# EAGLE design BatManagement (EAGLE 9.6.2)
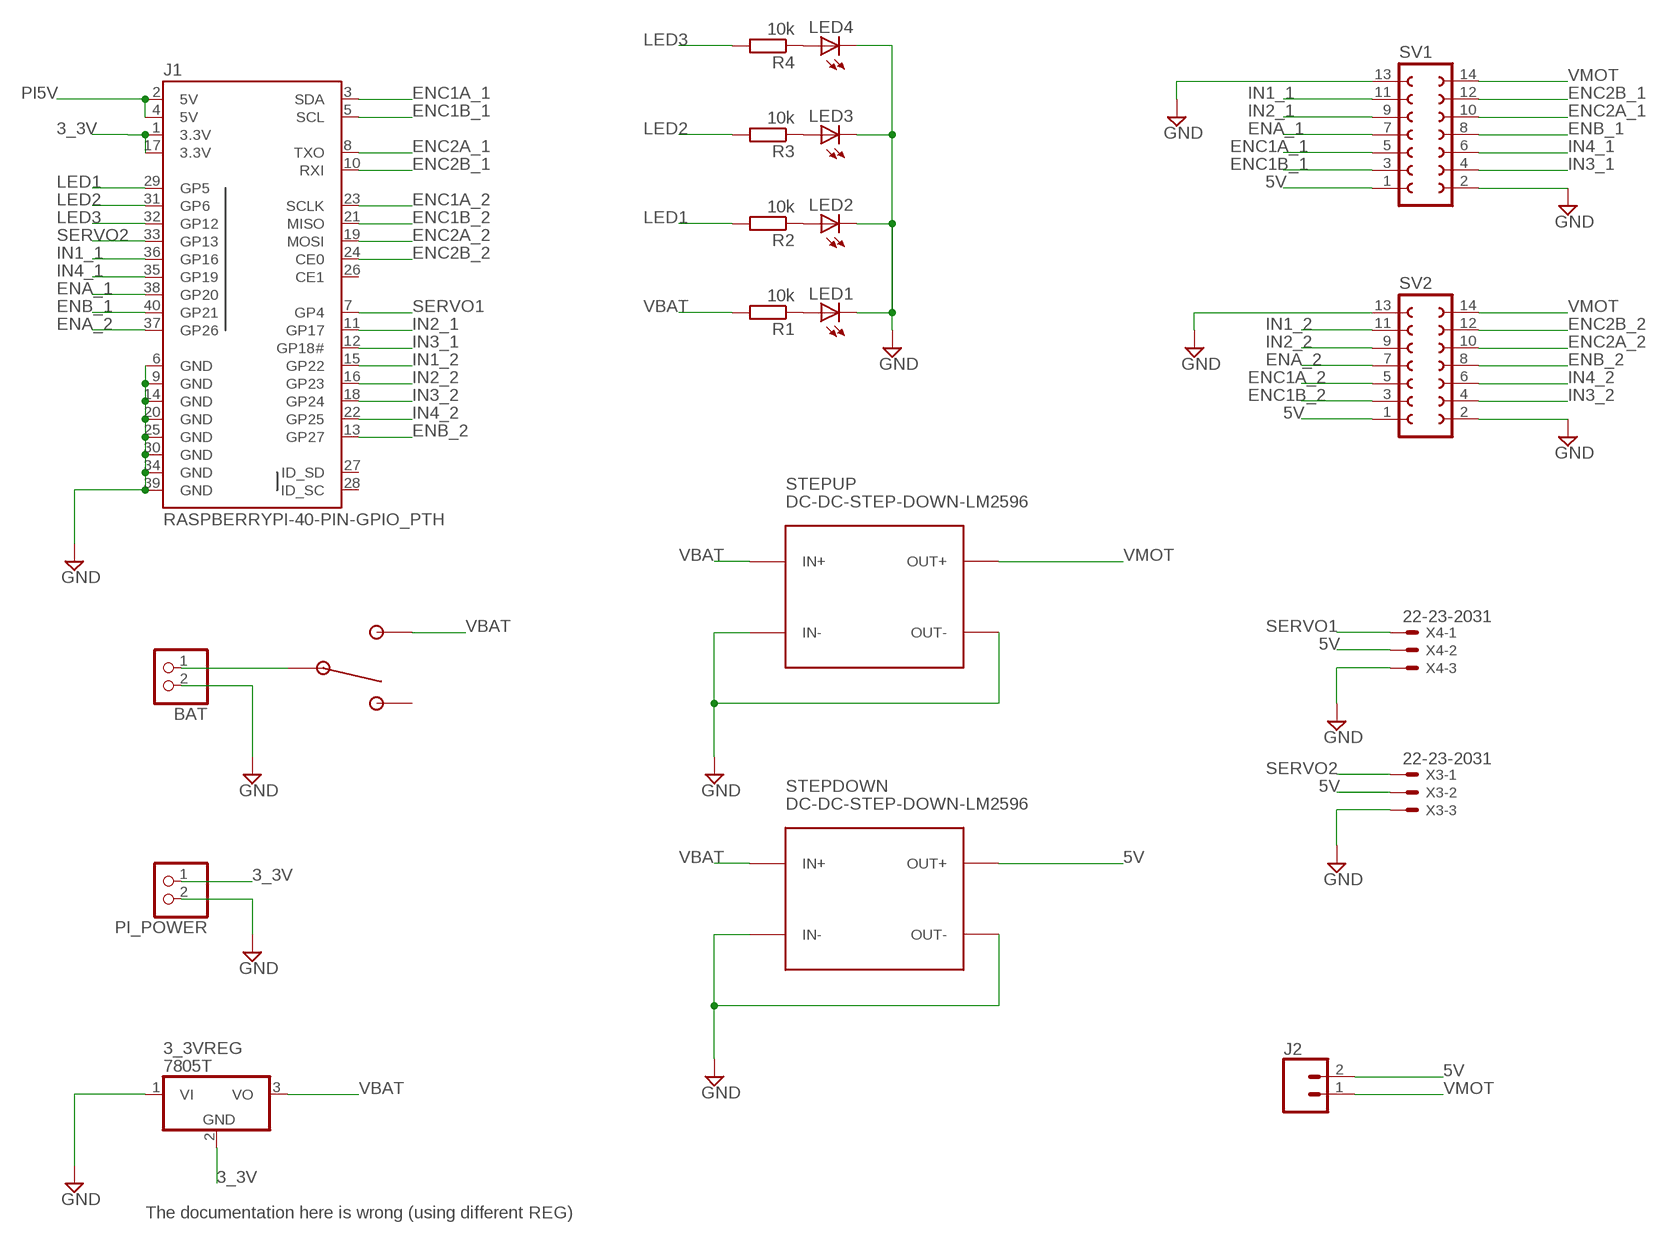
[diagram p0: schematic, sheet 1]

## Parts
3_3VREG  7805T  [TO220H]
BAT  JST_2PIN-THM  [JST-PH-2-THM]
J1  RASPBERRYPI-40-PIN-GPIO_PTH  [2X20_SHROUDED]
J2  CONN_02  [1X02]
LED1  LED5MM  [LED5MM]
LED2  LED5MM  [LED5MM]
LED3  LED5MM  [LED5MM]
LED4  LED5MM  [LED5MM]
PI_POWER  JST_2PIN-THM  [JST-PH-2-THM]
R1  10k  R-EU_0204/5  [0204/5]
R2  10k  R-EU_0204/5  [0204/5]
R3  10k  R-EU_0204/5  [0204/5]
R4  10k  R-EU_0204/5  [0204/5]
STEPDOWN  DC-DC-STEP-DOWN-LM2596  [DC-DC-STEP-DOWN-LM2596]
STEPUP  DC-DC-STEP-DOWN-LM2596  [DC-DC-STEP-DOWN-LM2596]
SV1  FE07-2  [FE07-2]
SV2  FE07-2  [FE07-2]
SW1  100SP1T2B4M6QE  [TOGGLE_RA]
X3  22-23-2031  [22-23-2031]
X4  22-23-2031  [22-23-2031]

## Nets
3_3V [Power]: 3_3VREG.2(GND) J1.1(3.3V) J1.17(3.3V) PI_POWER.1
5V [Power]: J2.2 STEPDOWN.OUT+ SV1.1 SV2.1 X3.2 X4.2
ENA_1: J1.38(GP20) SV1.7
ENA_2: J1.37(GP26) SV2.7
ENB_1: J1.40(GP21) SV1.8
ENB_2: J1.13(GP27) SV2.8
ENC1A_1: J1.3(SDA) SV1.5
ENC1A_2: J1.23(SCLK) SV2.5
ENC1B_1: J1.5(SCL) SV1.3
ENC1B_2: J1.21(MISO) SV2.3
ENC2A_1: J1.8(TXO) SV1.10
ENC2A_2: J1.19(MOSI) SV2.10
ENC2B_1: J1.10(RXI) SV1.12
ENC2B_2: J1.24(CE0) SV2.12
GND [Power]: 3_3VREG.1(VI) BAT.2 J1.6(GND) J1.9(GND) J1.14(GND) J1.20(GND) J1.25(GND) J1.30(GND) J1.34(GND) J1.39(GND) LED1.K(C) LED2.K(C) LED3.K(C) LED4.K(C) PI_POWER.2 STEPDOWN.IN- STEPDOWN.OUT- STEPUP.IN- STEPUP.OUT- SV1.2 SV1.13 SV2.2 SV2.13 X3.3 X4.3
IN1_1: J1.36(GP16) SV1.11
IN1_2: J1.15(GP22) SV2.11
IN2_1: J1.11(GP17) SV1.9
IN2_2: J1.16(GP23) SV2.9
IN3_1: J1.12(GP18#) SV1.4
IN3_2: J1.18(GP24) SV2.4
IN4_1: J1.35(GP19) SV1.6
IN4_2: J1.22(GP25) SV2.6
LED1: J1.29(GP5) R2.2
LED2: J1.31(GP6) R3.2
LED3: J1.32(GP12) R4.2
N$1: LED1.A R1.1
N$2: LED2.A R2.1
N$3: LED3.A R3.1
N$4: LED4.A R4.1
N$9 [Power]: BAT.1 SW1.2(COM)
PI5V: J1.2(5V) J1.4(5V)
SERVO1: J1.7(GP4) X4.1
SERVO2: J1.33(GP13) X3.1
VBAT [Power]: 3_3VREG.3(VO) R1.2 STEPDOWN.IN+ STEPUP.IN+ SW1.1
VMOT [Power]: J2.1 STEPUP.OUT+ SV1.14 SV2.14
Unconnected: J1.26(CE1) J1.27(ID_SD) J1.28(ID_SC) SW1.3

## Notes on the sheet
- The documentation here is wrong (using different REG)

## Library data of the parts
3_3VREG = linear:78*: Positive VOLTAGE REGULATOR Source: http://cache.national.com/ds/LM/LM78L05.pdf http://www.fairchildsemi.com/ds/LM/LM7805.pdf
BAT PI_POWER = adafruit:JST_2PIN: JST 2-Pin Connectors of various flavors SMT-RA (S2B-PH-SM4) 4UConnector #17311 SMT (B2B-PH-SM4) THM-RA (S2B-PH) THM (B2B-PH)
J1 = SparkFun-Connectors:RASPBERRYPI-40-PIN-GPIO: Raspberry Pi GPIO Header 2x20 pin connector, as found on B, B+, A+ models. Both shrouded PTH and SMT versions available. SparkFun Products: GPIO Shrouded Header <https://www.sparkfun.com/products/13054>- PTH SparkFun Pi Wedge (Preassembled) <https://www.sparkfun.com/products/13717>; PROD_ID: CONN-12263; SF_ID: PRT-13054
J2 = SparkFun-Connectors:CONN_02: Multi connection point. Often used as Generic Header-pin footprint for 0.1 inch spaced/style header connections On any of the 0.1 inch spaced packages, you can populate with these: Break Away Headers - Straight <https://www.sparkfun.com/products/116> (PRT-00116) Break Away Male Headers - Right Angle <https://www.sparkfun.com/products/553> (PRT-00553) Female Headers <https://www.sparkfun.com/products/115> (PRT-00115) Break Away Headers - Machine Pin <https://www.sparkfun.com/products/117> (PRT-00117) Break Away Female Headers - Swiss Machine Pin <https://www.sparkfun.com/products/743> (PRT-00743) For SCREWTERMINALS and SPRING TERMINALS visit here: Screw Terimnals on SparkFun.com <https://www.sparkfun.com/search/results?term=Screw+Terminals> (5mm/3.5mm/2.54mm spacing) This device is also useful as a general connection point to wire up your design to another part of your project. Our various solder wires solder well into these plated through hole pads. Hook-Up Wire - Assortment (Stranded, 22 AWG) <https://www.sparkfun.com/products/11375> (PRT-11375) Hook-Up Wire - Assortment (Solid Core, 22 AWG) <https://www.sparkfun.com/products/11367> (PRT-11367) View the entire wire category on our website here <https://www.sparkfun.com/categories/141> Special notes: Molex polarized connector foot print use with: PRT-08233 with associated crimp pins and housings. 2.54_SCREWTERM for use with PRT-10571. 3.5mm Screw Terminal footprints for PRT-08084 5mm Screw Terminal footprints for use with PRT-08432
LED1-LED4 = adafruit:LED: LED OSRAM: - CHIPLED LG R971, LG N971, LY N971, LG Q971, LY Q971, LO R971, LY R971 LH N974, LH R974 LS Q976, LO Q976, LY Q976 LO Q996 - Hyper CHIPLED LW Q18S LB Q993, LB Q99A, LB R99A - SideLED LS A670, LO A670, LY A670, LG A670, LP A670 LB A673, LV A673, LT A673, LW A673 LH A674 LY A675 LS A676, LA A676, LO A676, LY A676, LW A676 LS A679, LY A679, LG A679 - Hyper Micro SIDELED® LS Y876, LA Y876, LO Y876, LY Y876 LT Y87S - SmartLED LW L88C, LW L88S LB L89C, LB L89S, LG L890 LS L89K, LO L89K, LY L89K LS L896, LA L896, LO L896, LY L896 - TOPLED LS T670, LO T670, LY T670, LG T670, LP T670 LSG T670, LSP T670, LSY T670, LOP T670, LYG T670 LG T671, LOG T671, LSG T671 LB T673, LV T673, LT T673, LW T673 LH T674 LS T676, LA T676, LO T676, LY T676, LB T676, LH T676, LSB T676, LW T676 LB T67C, LV T67C, LT T67C, LS T67K, LO T67K, LY T67K, LW E67C LS E67B, LA E67B, LO E67B, LY E67B, LB E67C, LV E67C, LT E67C LW T67C LS T679, LY T679, LG T679 LS T770, LO T770, LY T770, LG T770, LP T770 LB T773, LV T773, LT T773, LW T773 LH T774 LS E675, LA E675, LY E675, LS T675 LS T776, LA T776, LO T776, LY T776, LB T776 LHGB T686 LT T68C, LB T68C - Hyper Mini TOPLED® LB M676 - Mini TOPLED Santana® LG M470 LS M47K, LO M47K, LY M47K Source: http://www.osram.convergy.de/
R1-R4 = rcl:R-EU_: RESISTOR, European symbol; SPICEPREFIX: R
STEPDOWN STEPUP = diy-modules:DC-DC-STEP-DOWN-LM2596: DC/DC Step-Down Regulator based on LM2596-ADJ chip LM2596 datasheet available here: http://www.ti.com/lit/ds/symlink/lm2596.pdf Click here to find device on ebay.com <http://www.ebay.com/sch/lm2596+power+regulator>
SV1 SV2 = con-lsta:FE07-2: FEMALE HEADER; OC_FARNELL: unknown; OC_NEWARK: unknown
SW1 = 100SP1T2B4M6QE:100SP1T2B4M6QE: Toggle Switch SPDT Through Hole, Right Angle 5A 120V Check prices <https://pricing.snapeda.com/parts/100SP1T2B4M6QE/E-Switch/view-part?ref=eda>; AVAILABILITY: Good; DESCRIPTION: Toggle Switch, 100 Series, SPDT, ON-NONE-ON, Sealed, 5A, 120VAC, 28VDC, R/A PC; MF: E-Switch; MP: 100SP1T2B4M6QE; PACKAGE: None; PRICE: None; PURCHASE-URL: https://pricing.snapeda.com/search/part/100SP1T2B4M6QE/?ref=eda
X3 X4 = con-molex:22-23-2031: .100" (2.54mm) Center Header - 3 Pin; MF: MOLEX; MPN: 22-23-2031; OC_FARNELL: 1462950; OC_NEWARK: 30C0862

## Net classes
0 default: width 0.4 mm, drill 0.25 mm, clearance 0.15 mm
1 Power: width 1 mm, drill 0.25 mm, clearance 0.15 mm

## Board
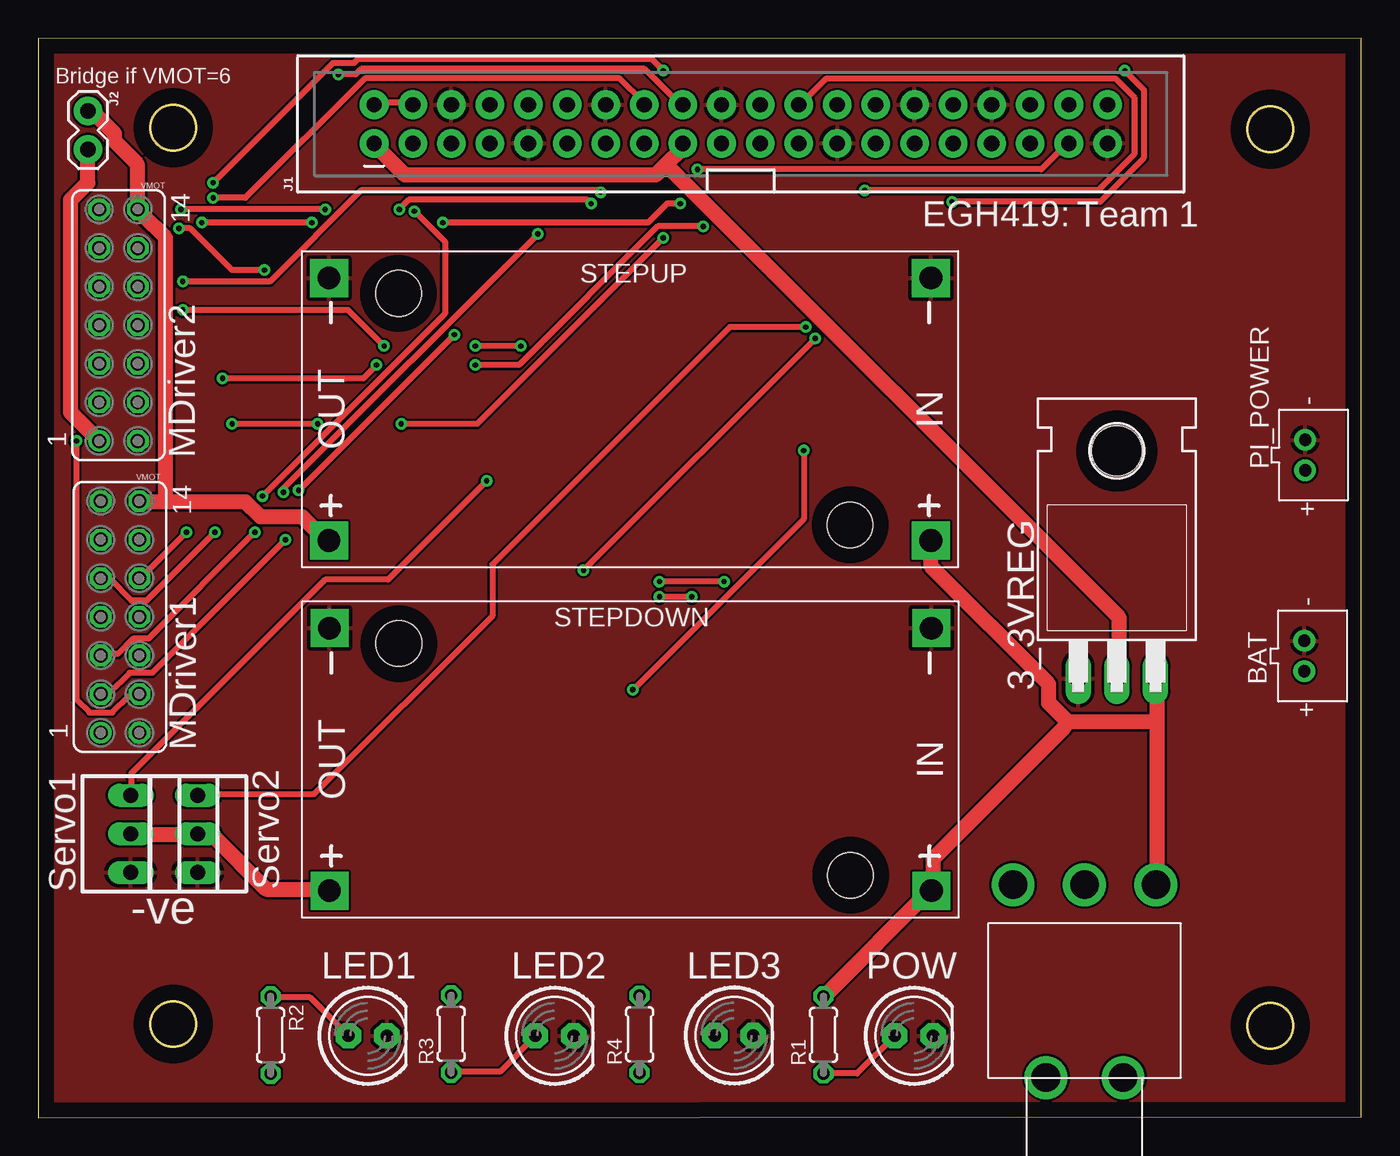
[diagram p1: board, top side]
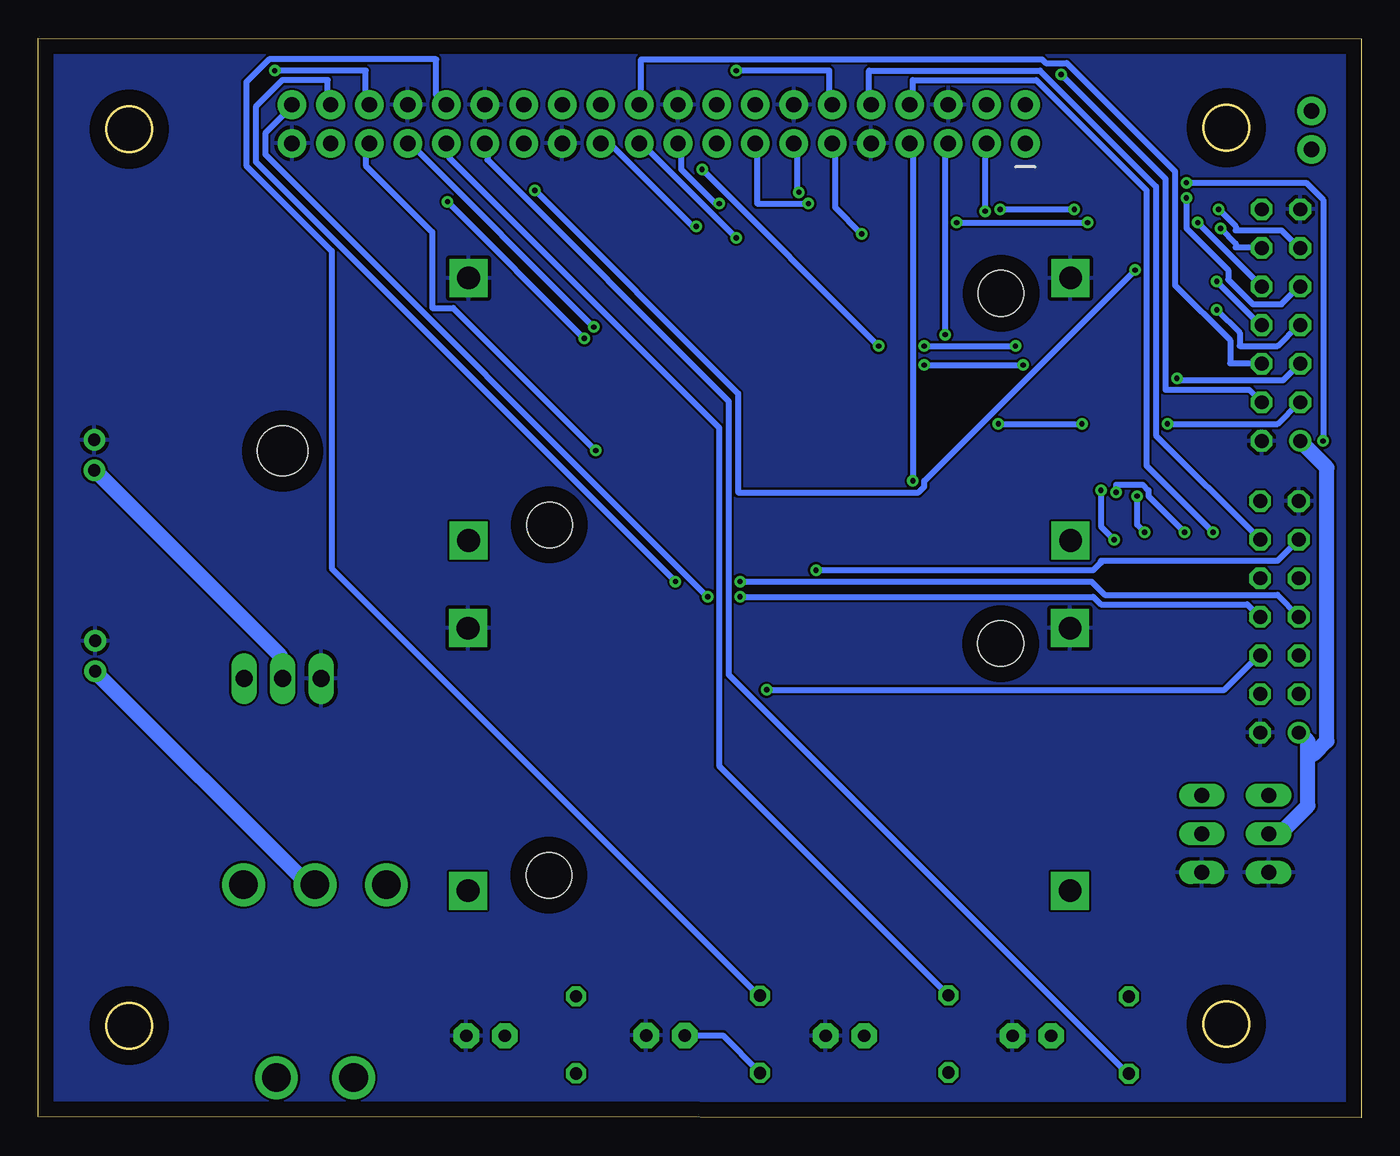
[diagram p2: board, bottom side, seen from below]

Size 87.1 x 71.06 mm. Coordinates in mm from the lower left corner, seen from the top.
Outline: 0,0 87.1,0.06 87.1,71.06 0,71 0,0
Outline: circle at 8.9,65.16 radius 1.5
Outline: circle at 81.1,6.06 radius 1.5
Outline: circle at 8.9,6.16 radius 1.5
Outline: circle at 81.1,65.06 radius 1.5
Copper layers (1*16): Top 0.035mm / dielectric 1.5mm / Bottom 0.035mm
Design rules "default": minimum track width 6mil, minimum drill 0.35mm, track to track 6mil, track to pad 6mil, pad to pad 6mil, via to via 6mil, smd to smd 6mil, copper to edge 40mil, drill to drill 6mil, minimum pad ring 10mil, minimum via ring 8mil, stop-mask expansion 4mil, vias tented up to drill 0mil, thermal gap 10mil

### Footprints (pad centres in the part's own frame; a part is rotated, then mirrored left to right if it is on the bottom)
TO220H = drill 1.118 long: 1 -2.54,-10.16; 2 0,-10.16; 3 2.54,-10.16 | hole 3.302: 0,4.826
JST-PH-2-THM = drill 0.8 pad 1.422: 1 1,0; 2 -1,0
2X20_SHROUDED = drill 1.016 pad 1.88: 1 -1.27,24.13; 2 1.27,24.13; 3 -1.27,21.59; 4 1.27,21.59; 5 -1.27,19.05; 6 1.27,19.05; 7 -1.27,16.51; 8 1.27,16.51; 9 -1.27,13.97; 10 1.27,13.97; 11 -1.27,11.43; 12 1.27,11.43; 13 -1.27,8.89; 14 1.27,8.89; 15 -1.27,6.35; 16 1.27,6.35; 17 -1.27,3.81; 18 1.27,3.81; 19 -1.27,1.27; 20 1.27,1.27; 21 -1.27,-1.27; 22 1.27,-1.27; 23 -1.27,-3.81; 24 1.27,-3.81; 25 -1.27,-6.35; 26 1.27,-6.35; 27 -1.27,-8.89; 28 1.27,-8.89; 29 -1.27,-11.43; 30 1.27,-11.43; 31 -1.27,-13.97; 32 1.27,-13.97; 33 -1.27,-16.51; 34 1.27,-16.51; 35 -1.27,-19.05; 36 1.27,-19.05; 37 -1.27,-21.59; 38 1.27,-21.59; 39 -1.27,-24.13; 40 1.27,-24.13
1X02 = drill 1.016 pad 1.88: 1 0,0; 2 2.54,0
LED5MM = drill 0.813 pad 1.676 octagon: A -1.27,0; K 1.27,0
0204/5 = drill 0.813 octagon: 1 -2.54,0; 2 2.54,0
DC-DC-STEP-DOWN-LM2596 = drill 1.5 pad 2.5 square: IN+ -19.812,8.636; IN- -19.812,-8.636; OUT+ 19.812,8.636; OUT- 19.812,-8.636 | hole 3: -14.478,7.62; 15.24,-7.62
FE07-2 = drill 0.914: 1 -7.62,1.27 | drill 0.914 octagon: 2 -7.62,-1.27; 3 -5.08,1.27; 4 -5.08,-1.27; 5 -2.54,1.27; 6 -2.54,-1.27; 7 0,1.27; 8 0,-1.27; 9 2.54,1.27; 10 2.54,-1.27; 11 5.08,1.27; 12 5.08,-1.27; 13 7.62,1.27; 14 7.62,-1.27
TOGGLE_RA = drill 1.88: 1 4.699,12.7; 2 0,12.7; 3 -4.699,12.7; P$4 -2.54,0; P$5 2.54,0
22-23-2031 = drill 1 long: 1 -2.54,0; 2 0,0; 3 2.54,0

### Placement (x,y rotation side)
3_3VREG  71,39.06 0 top
BAT  83.33,30.39 270 top
J1  46.25,65.4 90 top
J2  3.3,66.26 270 top
LED1  57.65,5.39 0 top
LED2  21.7,5.39 0 top
LED3  34,5.39 0 top
LED4  45.81,5.41 0 top
PI_POWER  83.39,43.61 270 top
R1  51.69,5.45 90 top
R2  15.31,5.44 270 top
R3  27.19,5.51 90 top
R4  39.59,5.49 90 top
STEPDOWN  38.99,23.58 180 top
STEPUP  38.96,46.63 180 top
SV1  5.4,32.96 90 top
SV2  5.3,52.16 90 top
SW1  68.87,2.63 0 top
X3  10.51,18.68 270 top
X4  6.11,18.68 270 top

### Tracks (layer width: path | path; a pad name or v marks a point on that pad's centre or on a via)
3_3V
  Top 1: 41.34,62.72 42.4,63.78 42.4,64.03 J1.17 | 41.34,62.72 40.65,62.03 24.15,62.03 22.15,64.03 J1.1 | 41.34,62.72 71.15,32.91 71.15,29.04 71.03,28.91 3_3VREG.2
  Bottom 1: PI_POWER.1 83.28,42.53 71.15,30.41 71.15,29.04 71.03,28.91 3_3VREG.2
5V
  Top 1: X4.2 6.15,18.66 10.4,18.66 X3.2 10.9,18.54 11.52,18.54 15.02,15.04 19.15,15.04 STEPDOWN.OUT+ | J2.2 3.27,63.66 3.27,61.53 2.15,60.41 2.15,46.41 SV2.1
  Bottom 1: 3.52,23.91 3.52,20.54 5.27,18.79 6.02,18.79 X4.2 | 3.52,23.91 3.52,24.79 4.02,25.29 SV1.1 | SV2.1 2.27,42.78 2.27,24.79 3.15,23.91 3.52,23.91
ENA_1  (via drill 0.35)
  Top 0.4: v45.15,35.28 v40.9,35.28
  Bottom 0.4: v40.9,35.28 17.77,35.28 16.9,34.41 5.52,34.41 4.15,33.03 SV1.7 | v45.15,35.28 72.78,62.91 72.78,66.53 71.03,68.28 68.03,68.28 68.03,66.91 67.9,66.78 J1.38
ENA_2  (via drill 0.35)
  Top 0.4: v9.52,53.16 20.4,53.16 v22.77,50.78 | v31.77,50.78 v28.77,50.78 | v43.4,62.41 66.03,62.41 67.78,64.16 J1.37
  Bottom 0.4: v9.52,53.16 8.02,51.66 8.02,50.78 5.52,50.78 4.15,52.16 SV2.7 | v28.77,50.78 v22.77,50.78 | v43.4,62.41 v31.77,50.78
ENB_1  (via drill 0.35)
  Top 0.4: v43.02,34.28 v40.9,34.28
  Bottom 0.4: v40.9,34.28 17.65,34.28 17.15,33.78 7.52,33.78 6.77,33.03 SV1.8 | v43.02,34.28 72.15,63.41 72.15,64.78 70.4,66.53 70.4,66.66 J1.40
ENB_2  (via drill 0.35)
  Top 0.4: v9.52,55.03 15.27,55.03 21.27,61.03 36.9,61.03 v37.02,60.91
  Bottom 0.4: v9.52,55.03 6.65,52.16 SV2.8 | v37.02,60.91 37.15,61.03 37.15,63.28 37.27,63.41 37.27,64.03 J1.13
ENC1A_1  (via drill 0.35)
  Top 0.4: v14.27,38.53 7.27,31.54 6.27,31.54 5.27,30.54 4.15,30.54 SV1.5 | v14.77,40.91 26.77,52.91 26.77,57.66 v24.77,59.66
  Bottom 0.4: v14.27,38.53 14.77,39.03 v14.77,40.91 | v24.77,59.66 24.77,64.03 J1.3
ENC1A_2  (via drill 0.35)
  Top 0.4: v12.15,48.66 21.4,48.66 v22.27,49.53 | v28.77,49.53 31.65,49.53 40.77,58.66 v43.77,58.66
  Bottom 0.4: v12.15,48.66 12.15,48.53 5.15,48.53 4.15,49.53 SV2.5 | v28.77,49.53 v22.27,49.53 | v43.77,58.66 44.02,58.66 49.4,64.03 50.02,64.03 J1.23
ENC1B_1  (via drill 0.35)
  Top 0.4: v16.27,38.03 7.52,29.29 6.02,29.29 4.65,27.91 4.15,27.91 SV1.3 | v27.4,51.53 v17.15,41.28
  Bottom 0.4: v16.27,38.03 17.15,38.91 v17.15,41.28 | v27.4,51.53 27.4,63.28 27.27,63.41 27.27,64.03 J1.5
ENC1B_2  (via drill 0.35)
  Top 0.4: v18.4,45.66 v12.77,45.66 | v23.9,45.66 28.9,45.66 v41.15,57.91
  Bottom 0.4: v12.77,45.66 5.52,45.66 4.15,47.03 SV2.3 | v23.9,45.66 v18.4,45.66 | v41.15,57.91 47.4,64.16 J1.21
ENC2A_1  (via drill 0.35)
  Top 0.4: v9.77,38.53 6.77,35.53 SV1.10
  Bottom 0.4: v9.77,38.53 14.15,42.91 14.15,61.03 21.4,68.28 29.52,68.28 29.52,66.91 29.65,66.78 J1.8
ENC2A_2  (via drill 0.35)
  Top 0.4: v18.02,58.91 v10.77,58.91 | v26.65,58.91 40.15,58.91 41.4,60.16 v42.27,60.16
  Bottom 0.4: v10.77,58.91 6.65,54.78 SV2.10 | v26.65,58.91 v18.02,58.91 | v42.27,60.16 42.52,60.16 44.77,62.41 44.77,63.28 44.9,63.41 44.9,64.03 J1.19
ENC2B_1
  Bottom 0.4: SV1.12 6.77,38.16 13.52,44.91 13.52,61.28 21.15,68.91 32.4,68.91 32.4,66.78 J1.10
ENC2B_2  (via drill 0.35)
  Top 0.4: v9.27,58.53 10.02,58.53 12.77,55.78 v14.9,55.78 | v54.4,61.03 69.78,61.03 72.15,63.41 72.15,67.16 70.9,68.41 51.9,68.41 50.15,66.66 J1.24
  Bottom 0.4: v9.27,58.53 8.27,57.53 8.27,57.28 6.65,57.28 SV2.12 | v14.9,55.78 28.77,41.91 28.77,41.53 29.15,41.16 41.02,41.16 41.02,47.66 v54.4,61.03
GND
  pour Top: -7.6,58.16 -7.6,71.16 1.9,80.66 95.9,80.66 106.9,69.66 106.9,4.16 94.9,-7.84 4.9,-7.84 -7.6,4.66
  pour Bottom: -13.1,66.16 1.4,80.66 104.4,80.66 113.4,71.66 113.4,56.16 113.4,16.66 87.4,-9.34 1.4,-9.34 -7.6,-0.34 -13.1,5.16
IN1_1  (via drill 0.35)
  Top 0.4: v51.15,51.28 v35.9,36.03 | v60.15,60.28 69.9,60.28 72.78,63.16 72.78,67.66 v71.53,68.91
  Bottom 0.4: v35.9,36.03 17.65,36.03 17.15,36.53 17.15,36.66 5.52,36.66 4.15,38.03 SV1.11 | v60.15,60.28 v51.15,51.28 | v71.53,68.91 65.53,68.91 65.53,66.91 65.4,66.78 J1.36
IN1_2  (via drill 0.35)
  Top 0.4: v18.9,59.78 v9.4,59.78 | v23.77,59.78 24.4,60.41 36.15,60.41 v36.4,60.16
  Bottom 0.4: v9.4,59.78 8.27,58.66 8.27,58.41 5.27,58.41 4.15,57.28 SV2.11 | v23.77,59.78 v18.9,59.78 | v36.4,60.16 39.77,60.16 39.77,63.91 39.9,64.03 J1.15
IN2_1  (via drill 0.35)
  Top 0.4: v11.65,38.53 7.15,34.03 6.15,34.03 4.77,35.41 4.15,35.41 SV1.9 | v16.15,41.16 16.15,41.41 v32.9,58.16
  Bottom 0.4: v11.65,38.53 14.02,40.91 14.02,41.28 14.4,41.66 16.15,41.66 v16.15,41.16 | v32.9,58.16 34.65,59.91 34.65,63.91 34.77,64.03 J1.11
IN2_2  (via drill 0.35)
  Top 0.4: v11.52,60.53 13.65,60.53 21.52,68.41 38.27,68.41 39.9,66.78 J1.16
  Bottom 0.4: v11.52,60.53 11.52,58.53 8.77,55.78 8.77,55.16 7.15,53.53 5.27,53.53 4.15,54.66 SV2.9
IN3_1  (via drill 0.35)
  Top 0.4: v2.52,44.53 2.52,27.54 3.4,26.66 4.9,26.66 6.02,27.79 6.65,27.79 SV1.4 | v11.52,61.53 19.4,69.41 20.77,69.41 21.02,69.66 40.4,69.66 v41.15,68.91
  Bottom 0.4: v2.52,44.53 2.52,60.41 3.65,61.53 v11.52,61.53 | v41.15,68.91 35.02,68.91 35.02,66.91 34.9,66.78 J1.12
IN3_2  (via drill 0.35)
  Top 0.4: v19.77,68.66 20.9,68.66 21.27,69.03 39.9,69.03 42.15,66.78 42.4,66.78 J1.18
  Bottom 0.4: SV2.4 7.4,47.91 12.9,47.91 12.9,61.78 v19.77,68.66
IN4_1  (via drill 0.35)
  Top 0.4: v39.15,28.16 50.4,39.41 v50.4,43.91
  Bottom 0.4: v39.15,28.16 9.02,28.16 6.77,30.41 SV1.6 | v50.4,43.91 59.77,53.28 61.15,53.28 61.15,58.28 65.53,62.66 65.53,63.28 65.4,63.41 65.4,64.03 J1.35
IN4_2
  Bottom 0.4: SV2.6 6.65,49.66 8.65,49.66 8.65,51.16 12.27,54.78 12.27,62.28 19.4,69.41 20.77,69.41 21.02,69.66 47.4,69.66 47.4,66.78 J1.22
LED1
  Bottom 0.4: R2.2 15.4,2.91 41.65,29.16 41.65,47.16 57.52,63.03 57.52,63.91 57.65,64.03 J1.29
LED2
  Bottom 0.4: R3.2 27.27,8.16 42.27,23.16 42.27,45.41 60.02,63.16 60.02,63.28 60.15,63.41 60.15,64.03 J1.31
LED3
  Bottom 0.4: R4.2 39.65,8.04 67.78,36.16 67.78,57.03 73.4,62.66 73.4,68.16 71.9,69.66 60.9,69.66 60.9,67.28 60.27,66.66 J1.32
N$1
  Top 0.4: R1.1 53.9,2.91 LED1.A
N$2
  Top 0.4: R2.1 15.4,7.91 17.9,7.91 20.4,5.41 LED2.A
N$3
  Top 0.4: R3.1 27.27,3.04 30.4,3.04 32.65,5.29 LED3.A
N$4
  Bottom 0.4: LED4.A 42.02,5.41 39.65,3.04 R4.1
N$9
  Bottom 1: BAT.1 83.28,29.29 69.4,15.41 68.9,15.41 SW1.2
PI5V
  Top 0.4: J1.2 22.15,66.78 24.65,66.78 J1.4
SERVO1  (via drill 0.35)
  Top 0.4: v29.52,41.91 23.02,35.41 18.9,35.41 6.15,22.66 6.15,21.29 X4.1
  Bottom 0.4: v29.52,41.91 29.52,63.28 29.65,63.41 29.65,64.03 J1.7
SERVO2  (via drill 0.35)
  Top 0.4: v50.52,52.03 45.52,52.03 29.9,36.41 29.9,33.03 18.15,21.29 10.52,21.29 X3.1
  Bottom 0.4: v50.52,52.03 62.65,64.16 J1.33
VBAT
  Top 1: R1.2 51.77,8.04 58.77,15.04 STEPDOWN.IN+ 58.9,15.54 58.9,17.04 67.53,25.66 67.78,26.04 | 73.65,26.04 73.65,15.41 SW1.1 | 73.65,26.04 73.65,28.79 3_3VREG.3 | 67.78,26.04 66.53,27.29 66.53,28.54 58.77,36.28 58.77,37.91 STEPUP.IN+ | 73.65,26.04 67.78,26.04
VMOT
  Top 1: J2.1 3.4,66.16 3.65,66.16 5.02,64.78 5.02,64.28 6.52,62.78 6.52,59.78 SV2.14 6.9,59.41 8.4,57.91 8.4,40.53 | 8.4,40.53 13.65,40.53 14.65,39.53 17.4,39.53 19.02,37.91 STEPUP.OUT+ | 8.4,40.53 6.77,40.53 SV1.14

### Text on the board
tNames: Bridge if VMOT=6 | VMOT | EGH419: | Team 1 | MDriver2 | VMOT | MDriver1 | Servo1 | Servo2 | -ve | LED1 | LED2 | LED3 | POW
200bmp: C:/Users/CodyS/OneDrive - Queensland University of Technology/Uni Coursework/2021/EGH419 Group 1 Shared Folder/Git Stuff/EGH419/LOGO.bmp